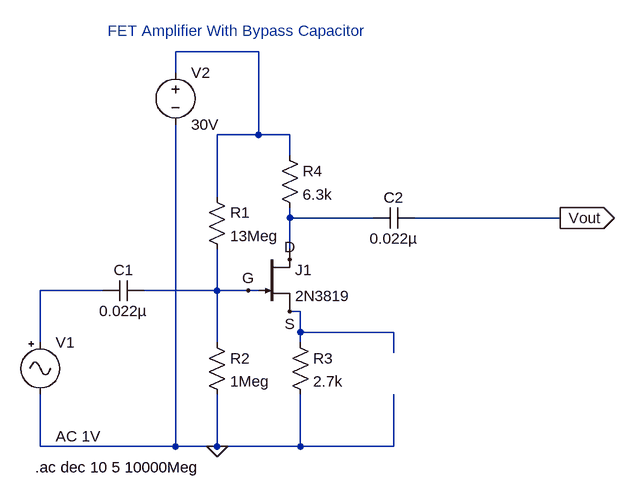
[diagram p0: schematic fetAmp1.asc]
fetAmp1.asc, the LTspice schematic file:
Version 4
SHEET 1 880 680
WIRE -16 -256 -144 -256
WIRE -144 -224 -144 -256
WIRE -16 -128 -16 -256
WIRE -16 -128 -80 -128
WIRE 32 -128 -16 -128
WIRE 32 -96 32 -128
WIRE -80 -32 -80 -128
WIRE 32 0 32 -16
WIRE 160 0 32 0
WIRE 448 0 224 0
WIRE 32 48 32 0
WIRE -256 112 -352 112
WIRE -80 112 -80 48
WIRE -80 112 -192 112
WIRE -32 112 -80 112
WIRE -16 112 -32 112
WIRE 48 144 32 144
WIRE 48 176 48 144
WIRE 192 176 48 176
WIRE -352 192 -352 112
WIRE -80 192 -80 112
WIRE 48 192 48 176
WIRE 192 208 192 176
WIRE -352 352 -352 272
WIRE -144 352 -144 -144
WIRE -144 352 -352 352
WIRE -80 352 -80 272
WIRE -80 352 -144 352
WIRE 48 352 48 272
WIRE 48 352 -80 352
WIRE 192 352 192 272
WIRE 192 352 48 352
FLAG -80 352 0
FLAG 448 0 Vout
IOPIN 448 0 Out
FLAG -32 112 G
FLAG 32 64 D
FLAG 32 144 S
SYMBOL njf -16 48 R0
SYMATTR InstName J1
SYMATTR Value 2N3819
SYMBOL cap -192 96 R90
WINDOW 0 0 32 VBottom 2
WINDOW 3 32 32 VTop 2
SYMATTR InstName C1
SYMATTR Value 0.022µ
SYMBOL res -96 -48 R0
SYMATTR InstName R1
SYMATTR Value 13Meg
SYMBOL res -96 176 R0
SYMATTR InstName R2
SYMATTR Value 1Meg
SYMBOL res 32 176 R0
SYMATTR InstName R3
SYMATTR Value 2.7k
SYMBOL res 16 -112 R0
SYMATTR InstName R4
SYMATTR Value 6.3k
SYMBOL voltage -144 -240 R0
SYMATTR InstName V2
SYMATTR Value 30V
SYMBOL cap 224 -16 R90
WINDOW 0 0 32 VBottom 2
WINDOW 3 32 32 VTop 2
SYMATTR InstName C2
SYMATTR Value 0.022µ
SYMBOL Misc\\signal -352 176 R0
WINDOW 3 24 160 Left 2
WINDOW 123 24 132 Left 2
WINDOW 39 0 0 Left 0
SYMATTR Value AC 1V
SYMATTR InstName V1
TEXT -360 384 Left 2 !.ac dec 10 5 10000Meg
TEXT -248 -288 Left 2 ;FET Amplifier With Bypass Capacitor

The netlist it stands for:
* fetAmp1.asc
J1 N002 G S 2N3819
C1 G N003 0.022µ
R1 N001 G 13Meg
R2 G 0 1Meg
R3 S 0 2.7k
R4 N001 N002 6.3k
V2 N001 0 30V
C2 Vout N002 0.022µ
V1 N003 0 AC 1V
.model NJF NJF
.model PJF PJF
.lib standard.jft
.ac dec 10 5 10000Meg
* FET Amplifier With Bypass Capacitor
.backanno
.end